# Altium schematic sheet epic.SchDoc: Ultrasonic
size Letter; Author: Kuo, Huang; Organization: Altium Limited; Address1: L3, 12a Rodborough Rd; Address2: Frenchs Forest; Address3: NSW; Address4: Australia 2086; Revision: 2.0; SheetNumber: 3; SheetTotal: 7
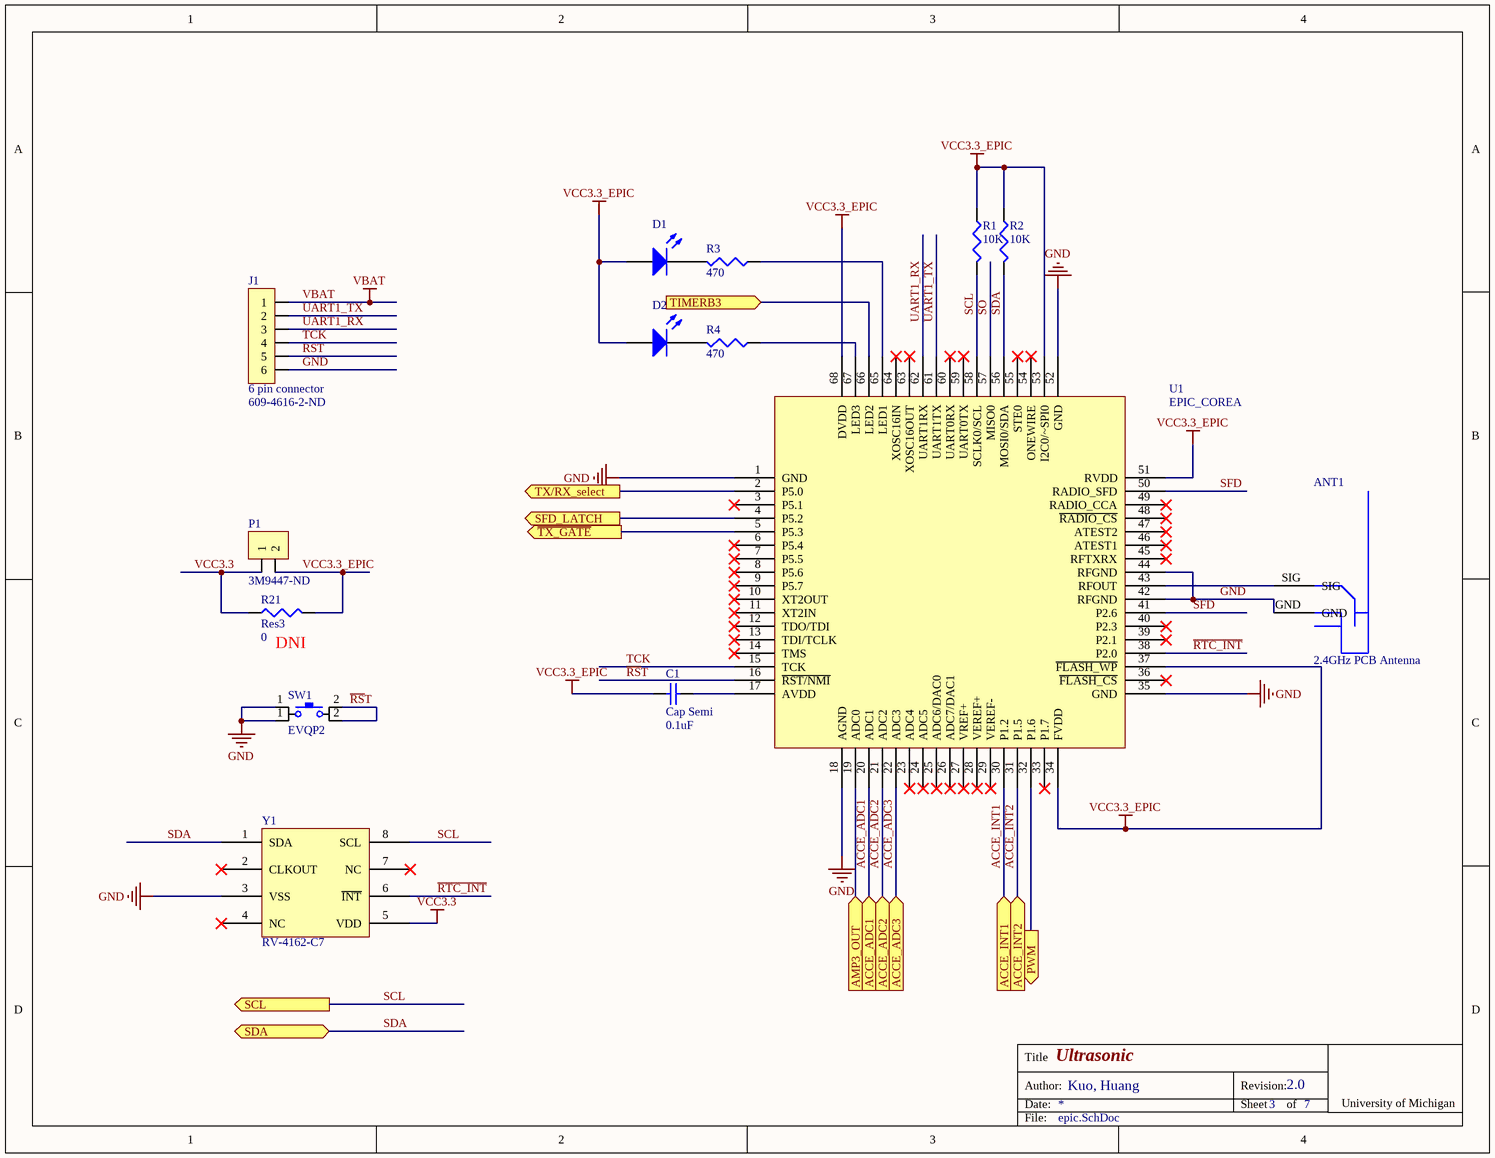
[diagram p0: epic.SchDoc]

## Parts
ANT1  2.4GHz PCB Antenna  [Inverted F Antenna]
C1  Cap Semi  value 0.1uF  [1608[0603]]
D1  LED3  [J1-0603]  (value not drawn)
D2  LED3  [J1-0603]  (value not drawn)
J1  6 pin connector  Supplier Part Number 2: 609-4616-2-ND  [Micro USB]
P1  Supplier Part Number 1: 3M9447-ND  [1x2 header]  (hidden comment: 1 x 2 header)
R1  10K  [J1-0603]
R2  10K  [J1-0603]
R3  470  [J1-0603]
R4  470  [J1-0603]
R21  Res3  value 0  [J1-0603]
SW1  EVQP2  [EVQP2]
U1  EPIC_COREA  [EPIC_LCC68]
Y1  RV-4162-C7  [RV4162]

## Ports
ACCE_ADC1 (in), ACCE_ADC2 (in), ACCE_ADC3 (in), ACCE_INT1 (in), ACCE_INT2 (in), AMP3_OUT (in), PWM (out), SCL (out), SDA (bidir), SFD_LATCH (out), TIMERB3 (in), TX/RX_select (out), ~{TX_GATE} (out)

## Nets
GND: ANT1.GND J1.6 SW1.1 U1.1(GND) U1.18(AGND) U1.35(GND) U1.42(RFGND) U1.44(RFGND) U1.52(GND) Y1.3(VSS)
VBAT: J1.1
VCC3.3: P1.1 R21.1 Y1.5(VDD)
VCC3.3_EPIC: C1.1 D1.1(A) D2.1(A) P1.2 R1.1 R2.1 R21.2 U1.34(FVDD) U1.37(~{FLASH_WP}) U1.51(RVDD) U1.53(I2C0/~SPI0) U1.68(DVDD)
ACCE_ADC1: U1.20(ADC1) ; port ACCE_ADC1
ACCE_ADC2: U1.21(ADC2) ; port ACCE_ADC2
ACCE_ADC3: U1.22(ADC3) ; port ACCE_ADC3
ACCE_INT1: U1.30(P1.2) ; port ACCE_INT1
ACCE_INT2: U1.31(P1.5) ; port ACCE_INT2
AMP3_OUT: U1.19(ADC0) ; port AMP3_OUT
PWM: U1.32(P1.6) ; port PWM
~{RS}T: J1.5 SW1.2 U1.16(~{RST/NMI})
~{RTC_INT}: U1.38(P2.0) Y1.6(~{INT})
SCL: R1.2 U1.58(SCLK0/SCL) Y1.8(SCL) ; port SCL
SDA: R2.2 U1.56(MOSI0/SDA) Y1.1(SDA) ; port SDA
SFD: U1.41(P2.6) U1.50(RADIO_SFD)
SFD_LATCH: U1.4(P5.2) ; port SFD_LATCH
SO: U1.57(MISO0)
~{TX_GATE}: U1.5(P5.3) ; port ~{TX_GATE}
TCK: J1.4 U1.15(TCK)
TIMERB3: U1.66(LED2) ; port TIMERB3
TX/RX_select: U1.2(P5.0) ; port TX/RX_select
UART1_RX: J1.3 U1.62(UART1RX)
UART1_TX: J1.2 U1.61(UART1TX)
NetANT1_SIG: ANT1.SIG U1.43(RFOUT)
NetC1_2: C1.2 U1.17(AVDD)
NetD1_2: D1.2(K) R3.2
NetD2_2: D2.2(K) R4.2
NetR3_1: R3.1 U1.65(LED1)
NetR4_1: R4.1 U1.67(LED3)

Not connected (* = marked no-connect by the designer): U1 3(P5.1)* 6(P5.4)* 7(P5.5)* 8(P5.6)* 9(P5.7)* 10(XT2OUT)* 11(XT2IN)* 12(TDO/TDI)* 13(TDI/TCLK)* 14(TMS)* 23(ADC4)* 24(ADC5)* 25(ADC6/DAC0)* 26(ADC7/DAC1)* 27(VREF+)* 28(VEREF+)* 29(VEREF-)* 33(P1.7)* 36(~{FLASH_CS})* 39(P2.1)* 40(P2.3)* 45(RFTXRX)* 46(ATEST1)* 47(ATEST2)* 48(~{RADIO_CS})* 49(RADIO_CCA)* 54(ONEWIRE)* 55(STE0)* 59(UART0TX)* 60(UART0RX)* 63(XOSC16OUT)* 64(XOSC16IN)*; Y1 2(CLKOUT)* 4(NC)* 7(NC)*

## Notes on the sheet
- (near R21) DNI
- Title
- Date:
- Author:
- Revision:
- Sheet
- of
- University of Michigan
- File:

## Library data of the parts
C1 = Cap Semi: Capacitor (Semiconductor SIM Model); Published: 8-Jun-2000; LatestRevisionDate: 29-May-2009; LatestRevisionNote: IPC-7351 Footprint Added.; PackageReference: C1206; Publisher: Altium Limited; PackageDescription: Chip Capacitor
D1 D2 = LED3: Typical BLUE SiC LED; Published: 8-Jun-2000; LatestRevisionDate: 17-Dec-2003; LatestRevisionNote: PCB Footprint replaced.; DatasheetVersion: 16-Apr-2002; PackageVersion: 16-Apr-2002; PackageReference: 3.5X2.8X1.9; Publisher: Altium Limited; PackageDescription: SM LED; 2 C-Bend Leads; Body 3.5 x 2.8 x 1.9 mm, inc leads (LxWxH typ)
P1 = 1 x 2 header: 100 mils standard header; Supplier 1: Digi-Key
R1-R4 R21 = Res3: Resistor; Published: 8-Jun-2000; LatestRevisionDate: 29-May-2009; LatestRevisionNote: IPC-7351 Footprint Added.; PackageReference: J1-0603; Publisher: Altium Limited; PackageDescription: Chip Resistor
  R1 R2: Value: 10K
  R3 R4: Value: 470
SW1 = EVQP2: Switch; Supplier 1: Digi-Key; Supplier Part Number 1: P12298SCT-ND
U1 = EPIC_COREA: EPIC Core
Y1 = RV-4162-C7: Real Time Clock Module with I2C Bus; Supplier 1: Allied; Supplier Part Number 1: R1033504
J1 = 6 pin connector: Supplier 1: Digi-Key; Supplier Part Number 1: 732-2018-2-ND; Supplier 2: Digi-Key